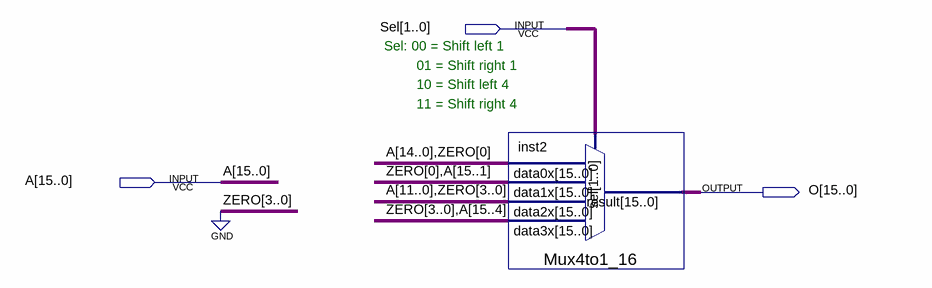
[diagram p0: schematic sheet]
// Quartus schematic ALU3.bdf as structural Verilog: 1 symbols, 3 pins
module ALU3 (
  input  [1:0] Sel,
  input  [15:0] A,
  output [15:0] O
);

  Mux4to1_16 inst2 (
    .data3x({4'b0000, A[15:4]}), .data2x({A[11:0], 4'b0000}), .data1x({1'b0, A[15:1]}),
    .data0x({A[14:0], 1'b0}), .sel(Sel), .result(O));

  // Notes on the sheet:
  //   Sel: 00 = Shift left 1 
  //    01 = Shift right 1 
  //    10 = Shift left 4 
  //    11 = Shift right 4 
endmodule
